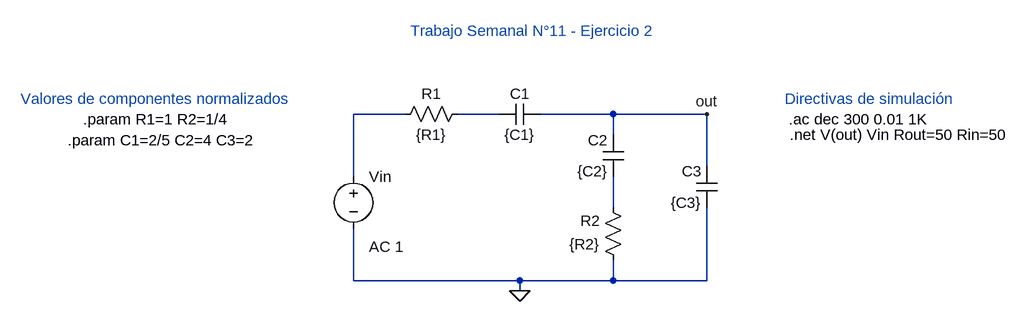
[diagram p0: schematic TS11_ej2.asc]
TS11_ej2.asc, the LTspice schematic file:
Version 4
SHEET 1 952 680
WIRE -16 144 -96 144
WIRE 128 144 64 144
WIRE 304 144 192 144
WIRE 448 144 304 144
WIRE 304 176 304 144
WIRE 448 224 448 144
WIRE -96 240 -96 144
WIRE 304 288 304 240
WIRE -96 400 -96 320
WIRE 160 400 -96 400
WIRE 304 400 304 368
WIRE 304 400 160 400
WIRE 448 400 448 288
WIRE 448 400 304 400
WIRE 160 416 160 400
FLAG 160 416 0
FLAG 448 144 out
SYMBOL res 80 128 R90
WINDOW 0 0 56 VBottom 2
WINDOW 3 32 56 VTop 2
SYMATTR InstName R1
SYMATTR Value {R1}
SYMBOL res 320 384 R180
WINDOW 0 36 76 Left 2
WINDOW 3 36 40 Left 2
SYMATTR InstName R2
SYMATTR Value {R2}
SYMBOL cap 192 128 R90
WINDOW 0 0 32 VBottom 2
WINDOW 3 32 32 VTop 2
SYMATTR InstName C1
SYMATTR Value {C1}
SYMBOL cap 320 240 R180
WINDOW 0 24 56 Left 2
WINDOW 3 24 8 Left 2
SYMATTR InstName C2
SYMATTR Value {C2}
SYMBOL cap 464 288 R180
WINDOW 0 24 56 Left 2
WINDOW 3 24 8 Left 2
SYMATTR InstName C3
SYMATTR Value {C3}
SYMBOL voltage -96 224 R0
WINDOW 123 24 124 Left 2
WINDOW 39 0 0 Left 0
SYMATTR InstName Vin
SYMATTR Value ""
SYMATTR Value2 AC 1
TEXT -8 16 Left 2 ;Trabajo Semanal N°11 - Ejercicio 2
TEXT -608 120 Left 2 ;Valores de componentes normalizados
TEXT -512 152 Left 2 !.param R1=1 R2=1/4
TEXT -536 184 Left 2 !.param C1=2/5 C2=4 C3=2
TEXT 568 120 Left 2 ;Directivas de simulación
TEXT 576 176 Left 2 !.net V(out) Vin Rout=50 Rin=50
TEXT 574 152 Left 2 !.ac dec 300 0.01 1K

The netlist it stands for:
* TS11_ej2.asc
R1 N002 N001 {R1}
R2 0 N003 {R2}
C1 out N002 {C1}
C2 N003 out {C2}
C3 0 out {C3}
Vin N001 0 AC 1
* Trabajo Semanal N°11 - Ejercicio 2
* Valores de componentes normalizados
.param R1=1 R2=1/4
.param C1=2/5 C2=4 C3=2
* Directivas de simulación
.net V(out) Vin Rout=50 Rin=50
.ac dec 300 0.01 1K
.backanno
.end